# Altium schematic sheet Sheet2.SchDoc
size A4; SheetNumber: 1; SheetTotal: 1
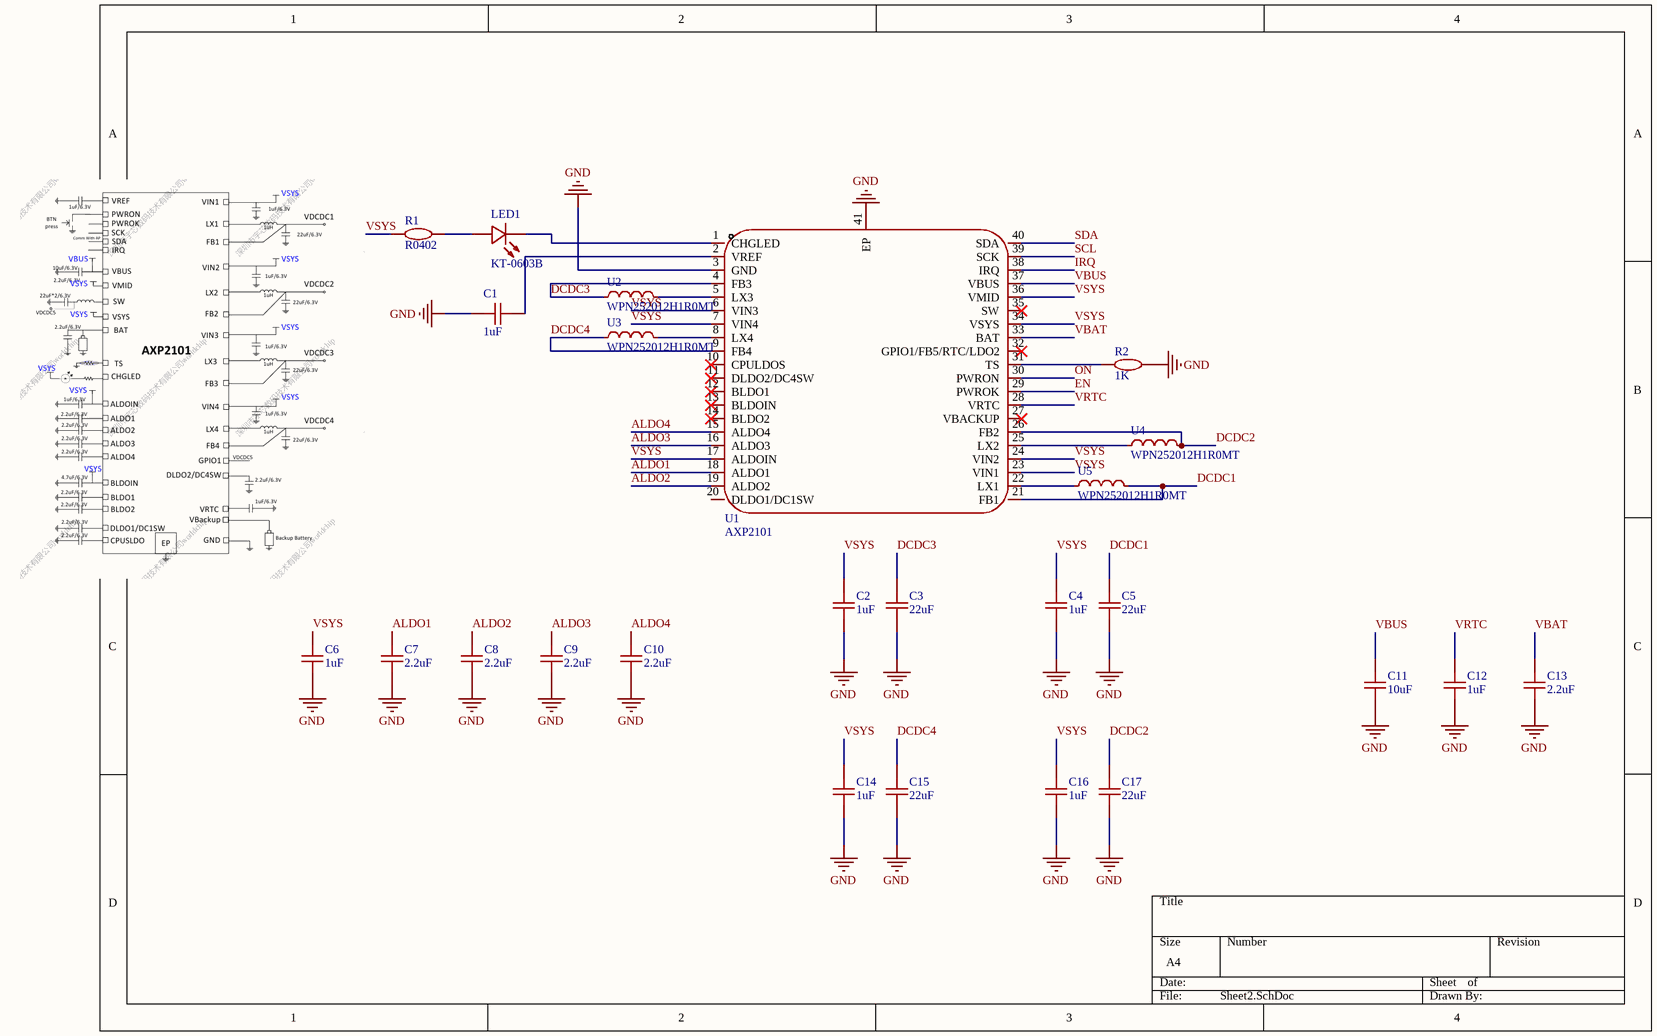
[diagram p0: Sheet2.SchDoc]

## Parts
C1  1uF  [C0402]
C2  1uF  [C0402]
C3  22uF  [C0603]
C4  1uF  [C0402]
C5  22uF  [C0603]
C6  1uF  [C0402]
C7  2.2uF  [C0402]
C8  2.2uF  [C0402]
C9  2.2uF  [C0402]
C10  2.2uF  [C0402]
C11  10uF  [C0603]
C12  1uF  [C0402]
C13  2.2uF  [C0402]
C14  1uF  [C0402]
C15  22uF  [C0603]
C16  1uF  [C0402]
C17  22uF  [C0603]
LED1  KT-0603B  [LED0603-BL]
R1  R0402  [R0402]
R2  1K  [R0402]
U1  AXP2101  [QFN-40_L5.0-W5.0-P0.40-TL-EP3.4]
U2  WPN252012H1R0MT  [IND-SMD_L2.5-W2.0_WPN252012H]
U3  WPN252012H1R0MT  [IND-SMD_L2.5-W2.0_WPN252012H]
U4  WPN252012H1R0MT  [IND-SMD_L2.5-W2.0_WPN252012H]
U5  WPN252012H1R0MT  [IND-SMD_L2.5-W2.0_WPN252012H]

## Nets
GND: C1.1 C2.1 C3.1 C4.1 C5.1 C6.1 C7.1 C8.1 C9.1 C10.1 C11.1 C12.1 C13.1 C14.1 C15.1 C16.1 C17.1 R2.2 U1.3(GND) U1.41(EP)
ALDO1: C7.2 U1.18(ALDO1)
ALDO2: C8.2 U1.19(ALDO2)
ALDO3: C9.2 U1.16(ALDO3)
ALDO4: C10.2 U1.15(ALDO4)
DCDC1: C5.2 U1.21(FB1) U5.2
DCDC2: C17.2 U1.26(FB2) U4.2
DCDC3: C3.2 U1.4(FB3) U2.1
DCDC4: C15.2 U1.9(FB4) U3.1
EN: U1.29(PWROK)
IRQ: U1.38(IRQ)
ON: U1.30(PWRON)
SCL: U1.39(SCK)
SDA: U1.40(SDA)
VBAT: C13.2 U1.33(BAT)
VBUS: C11.2 U1.37(VBUS)
VRTC: C12.2 U1.28(VRTC)
VSYS: C2.2 C4.2 C6.2 C14.2 C16.2 R1.1 U1.6(VIN3) U1.7(VIN4) U1.17(ALDOIN) U1.23(VIN1) U1.24(VIN2) U1.34(VSYS) U1.36(VMID)
NetC1_2: C1.2 U1.2(VREF)
NetLED1_1: LED1.1(K) U1.1(CHGLED)
NetLED1_2: LED1.2(A) R1.2
NetR2_1: R2.1 U1.31(TS)
NetU1_5: U1.5(LX3) U2.2
NetU1_8: U1.8(LX4) U3.2
NetU1_22: U1.22(LX1) U5.1
NetU1_25: U1.25(LX2) U4.1

Not connected (* = marked no-connect by the designer): U1 10(CPULDOS)* 11(DLDO2/DC4SW)* 12(BLDO1)* 13(BLDOIN)* 14(BLDO2)* 20(DLDO1/DC1SW) 27(VBACKUP)* 32(GPIO1/FB5/RTC/LDO2)* 35(SW)*

## Library data of the parts
C1 C2 C4 C6-C10 C12-C14 C16 = C0402
C3 C5 C11 C15 C17 = C0603
R2 = R0402
U2-U5 = WPN252012H1R0MT: 1uH